# EAGLE design M102X (EAGLE 6.6.0)
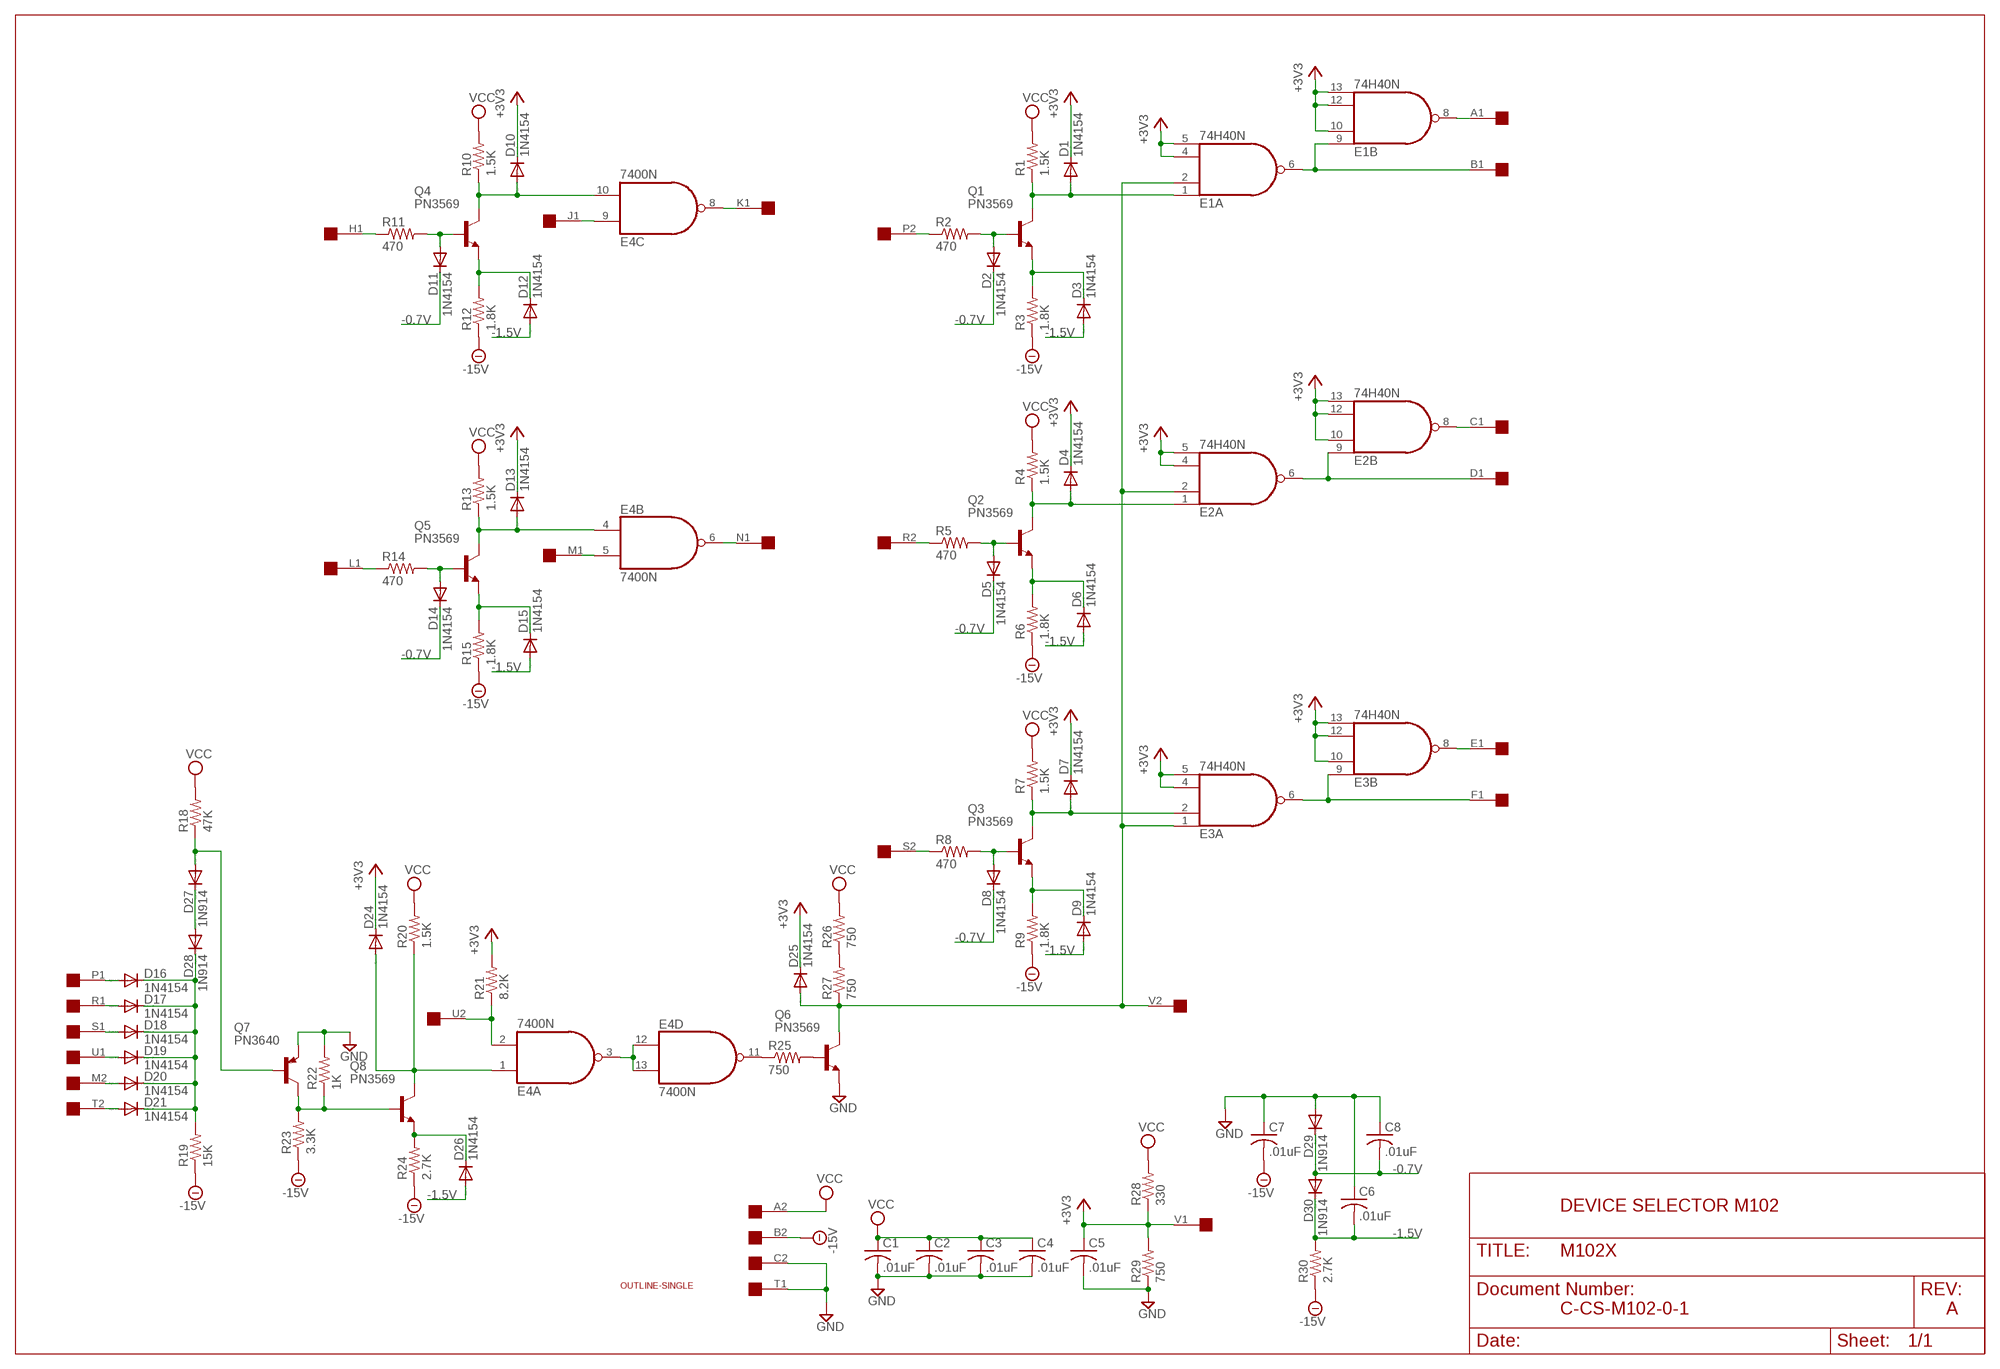
[diagram p0: schematic, sheet 1]

## Parts
C1  .01uF  C-US050-025X075  [C050-025X075]
C2  .01uF  C-US050-025X075  [C050-025X075]
C3  .01uF  C-US050-025X075  [C050-025X075]
C4  .01uF  C-US050-025X075  [C050-025X075]
C5  .01uF  C-US050-025X075  [C050-025X075]
C6  .01uF  C-US050-025X075  [C050-025X075]
C7  .01uF  C-US050-025X075  [C050-025X075]
C8  .01uF  C-US050-025X075  [C050-025X075]
D1  1N4154  1N4148DO35-10  [DO35-10]
D2  1N4154  1N4148DO35-10  [DO35-10]
D3  1N4154  1N4148DO35-10  [DO35-10]
D4  1N4154  1N4148DO35-10  [DO35-10]
D5  1N4154  1N4148DO35-10  [DO35-10]
D6  1N4154  1N4148DO35-10  [DO35-10]
D7  1N4154  1N4148DO35-10  [DO35-10]
D8  1N4154  1N4148DO35-10  [DO35-10]
D9  1N4154  1N4148DO35-10  [DO35-10]
D10  1N4154  1N4148DO35-10  [DO35-10]
D11  1N4154  1N4148DO35-10  [DO35-10]
D12  1N4154  1N4148DO35-10  [DO35-10]
D13  1N4154  1N4148DO35-10  [DO35-10]
D14  1N4154  1N4148DO35-10  [DO35-10]
D15  1N4154  1N4148DO35-10  [DO35-10]
D16  1N4154  1N4148DO35-10  [DO35-10]
D17  1N4154  1N4148DO35-10  [DO35-10]
D18  1N4154  1N4148DO35-10  [DO35-10]
D19  1N4154  1N4148DO35-10  [DO35-10]
D20  1N4154  1N4148DO35-10  [DO35-10]
D21  1N4154  1N4148DO35-10  [DO35-10]
D24  1N4154  1N4148DO35-10  [DO35-10]
D25  1N4154  1N4148DO35-10  [DO35-10]
D26  1N4154  1N4148DO35-10  [DO35-10]
D27  1N914  1N4148DO35-10  [DO35-10]
D28  1N914  1N4148DO35-10  [DO35-10]
D29  1N914  1N4148DO35-10  [DO35-10]
D30  1N914  1N4148DO35-10  [DO35-10]
E1  74H40N  74S20N  [DIL14]
E2  74H40N  74S20N  [DIL14]
E3  74H40N  74S20N  [DIL14]
E4  7400N  [DIL14]
Q1  PN3569  2N1613-NPN-TO39-EBC  [TO39]
Q2  PN3569  2N1613-NPN-TO39-EBC  [TO39]
Q3  PN3569  2N1613-NPN-TO39-EBC  [TO39]
Q4  PN3569  2N1613-NPN-TO39-EBC  [TO39]
Q5  PN3569  2N1613-NPN-TO39-EBC  [TO39]
Q6  PN3569  2N1613-NPN-TO39-EBC  [TO39]
Q7  PN3640  2N3635-PNP-TO39-EBC  [TO39]
Q8  PN3569  2N1613-NPN-TO39-EBC  [TO39]
R1  1.5K  R-US_0207/10  [0207/10]
R2  470  R-US_0207/10  [0207/10]
R3  1.8K  R-US_0207/10  [0207/10]
R4  1.5K  R-US_0207/10  [0207/10]
R5  470  R-US_0207/10  [0207/10]
R6  1.8K  R-US_0207/10  [0207/10]
R7  1.5K  R-US_0207/10  [0207/10]
R8  470  R-US_0207/10  [0207/10]
R9  1.8K  R-US_0207/10  [0207/10]
R10  1.5K  R-US_0207/10  [0207/10]
R11  470  R-US_0207/10  [0207/10]
R12  1.8K  R-US_0207/10  [0207/10]
R13  1.5K  R-US_0207/10  [0207/10]
R14  470  R-US_0207/10  [0207/10]
R15  1.8K  R-US_0207/10  [0207/10]
R18  47K  R-US_0207/10  [0207/10]
R19  15K  R-US_0207/10  [0207/10]
R20  1.5K  R-US_0207/10  [0207/10]
R21  8.2K  R-US_0207/10  [0207/10]
R22  1K  R-US_0207/10  [0207/10]
R23  3.3K  R-US_0207/10  [0207/10]
R24  2.7K  R-US_0207/10  [0207/10]
R25  750  R-US_0207/10  [0207/10]
R26  750  R-US_0207/10  [0207/10]
R27  750  R-US_0207/10  [0207/10]
R28  330  R-US_0207/10  [0207/10]
R29  750  R-US_0207/10  [0207/10]
R30  2.7K  R-US_0207/10  [0207/10]
U$8  SINGLE  [EDGE-CON2]
U$9  OUTLINE-SINGLE  [SINGLE]

## Nets
+3V3 [Supply]: C5.1 D1.C D4.C D7.C D10.C D13.C D24.C D25.C E1.4(A:I2) E1.5(A:I3) E1.10(B:I1) E1.12(B:I2) E1.13(B:I3) E2.4(A:I2) E2.5(A:I3) E2.10(B:I1) E2.12(B:I2) E2.13(B:I3) E3.4(A:I2) E3.5(A:I3) E3.10(B:I1) E3.12(B:I2) E3.13(B:I3) R21.2 R28.1 R29.2 U$8.V1
-0.7V: C8.2 D2.C D5.C D8.C D11.C D14.C D29.C D30.A
-1.5V: C6.2 D3.A D6.A D9.A D12.A D15.A D26.A D30.C R30.2
-15V [Supply]: C7.2 R3.1 R6.1 R9.1 R12.1 R15.1 R19.1 R23.1 R24.1 R30.1 U$8.B2
A1: E1.8(B:O) U$8.A1
B1: E1.6(A:O) E1.9(B:I0) U$8.B1
C1: E2.8(B:O) U$8.C1
D1: E2.6(A:O) E2.9(B:I0) U$8.D1
E1: E3.8(B:O) U$8.E1
F1: E3.6(A:O) E3.9(B:I0) U$8.F1
GND [Supply]: C1.2 C2.2 C3.2 C4.2 C5.2 C6.1 C7.1 C8.1 D29.A Q6.1(E) Q7.1(E) R22.2 R29.1 U$8.C2 U$8.T1
H1: R11.1 U$8.H1
J1: E4.9(C:I0) U$8.J1
K1: E4.8(C:O) U$8.K1
L1: R14.1 U$8.L1
M1: E4.5(B:I1) U$8.M1
M2: D20.A U$8.M2
N1: E4.6(B:O) U$8.N1
N$1: D27.A Q7.2(B) R18.1
N$2: E4.11(D:O) R25.1
N$3: Q6.2(B) R25.2
N$4: D27.C D28.A
N$5: R26.1 R27.2
N$6: Q7.3(C) Q8.2(B) R22.1 R23.2
N$7: D26.C Q8.1(E) R24.2
N$8: D24.A E4.1(A:I0) Q8.3(C) R20.1
N$9: E4.3(A:O) E4.12(D:I0) E4.13(D:I1)
N$10: D10.A E4.10(C:I1) Q4.3(C) R10.1
N$11: D11.A Q4.2(B) R11.2
N$12: D16.C D17.C D18.C D19.C D20.C D21.C D28.C R19.2
N$13: D1.A E1.1(A:I0) Q1.3(C) R1.1
N$14: D12.C Q4.1(E) R12.2
N$15: D13.A E4.4(B:I0) Q5.3(C) R13.1
N$16: D14.A Q5.2(B) R14.2
N$17: D2.A Q1.2(B) R2.2
N$18: D15.C Q5.1(E) R15.2
N$19: D3.C Q1.1(E) R3.2
N$20: D4.A E2.1(A:I0) Q2.3(C) R4.1
N$21: D5.A Q2.2(B) R5.2
N$22: D6.C Q2.1(E) R6.2
N$23: D7.A E3.2(A:I1) Q3.3(C) R7.1
N$24: D8.A Q3.2(B) R8.2
N$25: D9.C Q3.1(E) R9.2
P1: D16.A U$8.P1
P2: R2.1 U$8.P2
R1: D17.A U$8.R1
R2: R5.1 U$8.R2
S1: D18.A U$8.S1
S2: R8.1 U$8.S2
T2: D21.A U$8.T2
U1: D19.A U$8.U1
U2: E4.2(A:I1) R21.1 U$8.U2
V2: D25.A E1.2(A:I1) E2.2(A:I1) E3.1(A:I0) Q6.3(C) R27.1 U$8.V2
VCC [Supply]: C1.1 C2.1 C3.1 C4.1 R1.2 R4.2 R7.2 R10.2 R13.2 R18.2 R20.2 R26.2 R28.2 U$8.A2
Unconnected: U$8.D2 U$8.E2 U$8.F2 U$8.H2 U$8.J2 U$8.K2 U$8.L2 U$8.N2

## Notes on the sheet
- DEVICE SELECTOR M102
- C-CS-M102-0-1 | A

## Power pins joined to a net without a drawn wire
GND: E1.7(P:GND) E2.7(P:GND) E3.7(P:GND) E4.7(P:GND)
VCC: E1.14(P:VCC) E2.14(P:VCC) E3.14(P:VCC) E4.14(P:VCC)

## Library data of the parts
C1-C8 = rcl:C-US: CAPACITOR, American symbol
D1-D21 D24-D30 = diode:1N4148: DIODE high speed (Philips)
E1-E3 = 74xx-us:74*20: Dual 4-input NAND gate
E4 = 74xx-us:74*00: Quad 2-input NAND gate
Q1-Q6 Q8 = transistor:*-NPN-: NPN Transistror BF959 corrected 2008.03.06
Q7 = transistor:*-PNP-: PNP Transistror
R1-R15 R18-R30 = rcl:R-US_: RESISTOR, American symbol
U$8 = dec-con:SINGLE: Single-Height DEC board
U$9 = dec-con:OUTLINE-*: Board outlines for DEC boards.

## Net classes
1 Supply: width 0.813 mm

## Board
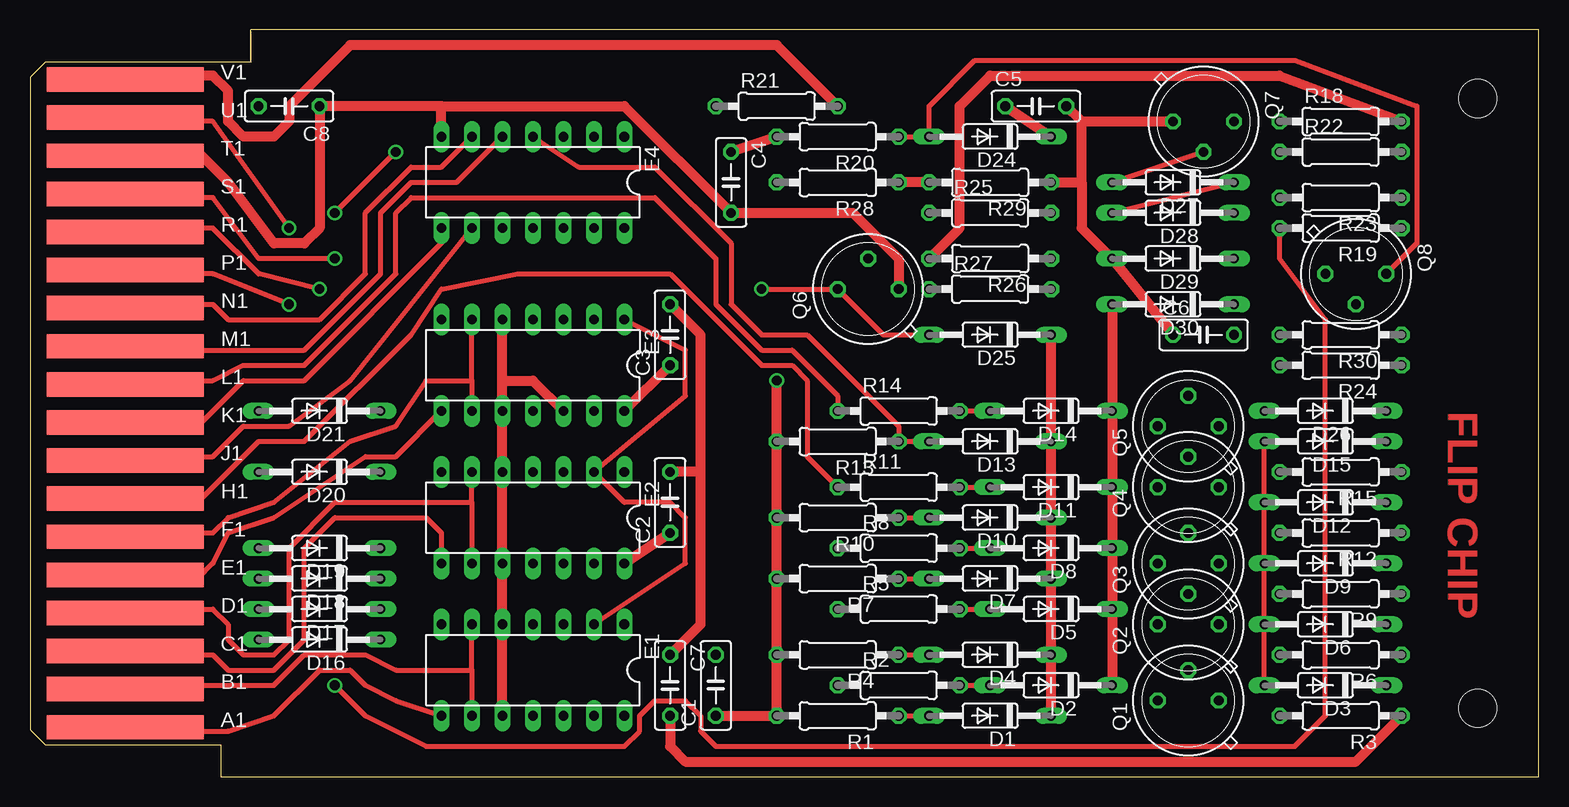
[diagram p1: board, top side]
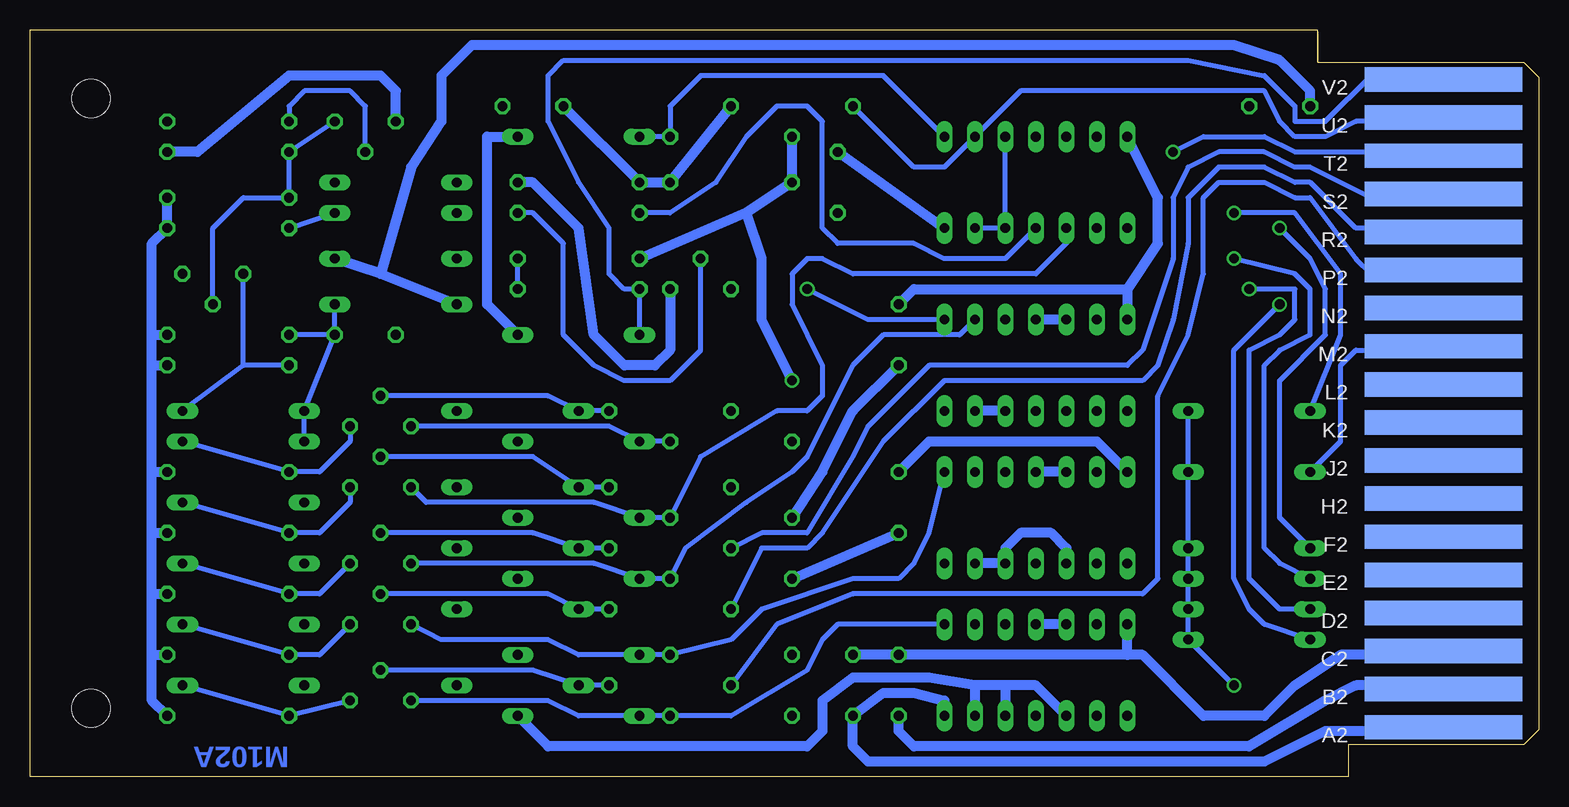
[diagram p2: board, bottom side, seen from below]

Size 125.73 x 62.23 mm. Coordinates in mm from the lower left corner, seen from the top.
Copper layers (1+16): Top 0.035mm / dielectric 1.5mm / Bottom 0.035mm
Design rules "16mils": minimum track width 16mil, minimum drill 32mil, track to track 15mil, track to pad 10mil, pad to pad 10mil, via to via 10mil, smd to smd 10mil, copper to edge 13mil, drill to drill 10mil, minimum pad ring 10mil, minimum via ring 8mil, stop-mask expansion 0mil, vias tented up to drill 0mil, thermal gap 10mil

### Footprints (pad centres in the part's own frame; a part is rotated, then mirrored left to right if it is on the bottom)
C050-025X075 = drill 0.813 octagon: 1 -2.54,0; 2 2.54,0
DO35-10 = drill 0.813 long: A 5.08,0; C -5.08,0
DIL14 = drill 0.813 long: 1 -7.62,-3.81; 2 -5.08,-3.81; 3 -2.54,-3.81; 4 0,-3.81; 5 2.54,-3.81; 6 5.08,-3.81; 7 7.62,-3.81; 8 7.62,3.81; 9 5.08,3.81; 10 2.54,3.81; 11 0,3.81; 12 -2.54,3.81; 13 -5.08,3.81; 14 -7.62,3.81
TO39 = drill 0.813 octagon: 1 0,-2.54; 2 2.54,0; 3 0,2.54
0207/10 = drill 0.813 octagon: 1 -5.08,0; 2 5.08,0
EDGE-CON2 = smd 13.106 x 2.032: A1 7.938,4.128; B1 7.938,7.303; C1 7.938,10.477; D1 7.938,13.652; E1 7.938,16.828; F1 7.938,20.003; H1 7.938,23.177; J1 7.938,26.352; K1 7.938,29.527; L1 7.938,32.703; M1 7.938,35.877; N1 7.938,39.053; P1 7.938,42.227; R1 7.938,45.403; S1 7.938,48.578; T1 7.938,51.752; U1 7.938,54.928; V1 7.938,58.102 | smd 13.106 x 2.032 bottom: A2 7.938,4.128; B2 7.938,7.303; C2 7.938,10.477; D2 7.938,13.652; E2 7.938,16.828; F2 7.938,20.003; H2 7.938,23.177; J2 7.938,26.352; K2 7.938,29.527; L2 7.938,32.703; M2 7.938,35.877; N2 7.938,39.053; P2 7.938,42.227; R2 7.938,45.403; S2 7.938,48.578; T2 7.938,51.752; U2 7.938,54.928; V2 7.938,58.102
SINGLE = hole 3.175: 120.65,56.515; 120.65,5.715

### Placement (x,y rotation side)
C1  57.15,7.62 90 top
C2  53.34,22.86 90 top
C3  53.34,36.83 90 top
C4  58.42,49.53 270 top
C5  83.82,55.88 0 top
C6  97.79,36.83 0 top
C7  53.34,7.62 270 top
C8  21.59,55.88 180 top
D1  80.01,5.08 180 top
D2  85.09,7.62 180 top
D3  107.95,7.62 180 top
D4  80.01,10.16 180 top
D5  85.09,13.97 180 top
D6  107.95,12.7 180 top
D7  80.01,16.51 180 top
D8  85.09,19.05 180 top
D9  107.95,17.78 180 top
D10  80.01,21.59 180 top
D11  85.09,24.13 180 top
D12  107.95,22.86 180 top
D13  80.01,27.94 180 top
D14  85.09,30.48 180 top
D15  107.95,27.94 180 top
D16  24.13,11.43 180 top
D17  24.13,13.97 180 top
D18  24.13,16.51 180 top
D19  24.13,19.05 180 top
D20  24.13,25.4 180 top
D21  24.13,30.48 180 top
D24  80.01,53.34 180 top
D25  80.01,36.83 180 top
D26  107.95,30.48 180 top
D27  95.25,49.53 180 top
D28  95.25,46.99 180 top
D29  95.25,43.18 180 top
D30  95.25,39.37 180 top
E1  41.91,8.89 180 top
E2  41.91,21.59 180 top
E3  41.91,34.29 180 top
E4  41.91,49.53 180 top
Q1  96.52,6.35 90 top
Q2  96.52,12.7 90 top
Q3  96.52,17.78 90 top
Q4  96.52,24.13 90 top
Q5  96.52,29.21 90 top
Q6  69.85,40.64 90 top
Q7  97.79,54.61 270 top
Q8  110.49,41.91 270 top
R1  67.31,5.08 180 top
R2  72.39,7.62 0 top
R3  109.22,5.08 180 top
R4  67.31,10.16 180 top
R5  72.39,13.97 0 top
R6  109.22,10.16 180 top
R7  67.31,16.51 180 top
R8  72.39,19.05 0 top
R9  109.22,15.24 180 top
R10  67.31,21.59 180 top
R11  72.39,24.13 0 top
R12  109.22,20.32 180 top
R13  67.31,27.94 180 top
R14  72.39,30.48 0 top
R15  109.22,25.4 180 top
R18  109.22,54.61 0 top
R19  109.22,45.72 180 top
R20  67.31,53.34 180 top
R21  62.23,55.88 0 top
R22  109.22,52.07 0 top
R23  109.22,48.26 180 top
R24  109.22,34.29 180 top
R25  80.01,46.99 0 top
R26  80.01,43.18 180 top
R27  80.01,40.64 0 top
R28  67.31,49.53 180 top
R29  80.01,49.53 180 top
R30  109.22,36.83 180 top
U$8  0,0 0 top
U$9  0,0 0 top

### Tracks (layer width: path | path; a pad name or v marks a point on that pad's centre or on a via)
+3V3
  Top 0.813: E1.10 E1.5 E2.10 E2.5 E3.10 39.37,33.02 | 39.37,33.02 E3.5 | R29.2 R28.1 | D25.C D13.C D10.C D7.C D4.C D1.C | U$8.V1 8.89,58.42 15.24,58.42 16.51,57.15 16.51,54.61 17.78,53.34 20.32,53.34 21.59,54.61 21.59,55.88 26.67,60.96 62.23,60.96 R21.2 | E3.12 41.91,33.02 39.37,33.02 | D24.C C5.1
  Bottom 0.813: E1.10 41.91,7.62 44.45,7.62 | 44.45,7.62 E1.12 | 46.99,7.62 E1.13 | 44.45,7.62 46.99,7.62 | 46.99,7.62 50.8,8.26 57.15,8.26 59.69,6.35 59.69,3.81 60.96,2.54 82.55,2.54 D1.C | E2.10 39.37,19.05 40.64,20.32 43.18,20.32 44.45,19.05 E2.12 E2.13 | E1.5 E1.4 | E2.5 E2.4 | E3.5 E3.4 | R21.2 R28.1 R29.2 C5.1 | D24.C 87.63,53.34 87.63,39.37 D25.C | E3.12 E3.13
-0.7V
  Top 0.813: D30.A D14.C D11.C D8.C D5.C D2.C
  Bottom 0.813: 96.52,41.91 D30.A | 96.52,41.91 D29.C | 96.52,41.91 93.98,50.8 91.44,54.61 91.44,58.42 88.9,60.96 25.4,60.96 21.59,59.69 19.05,57.15 C8.2
-1.5V
  Top 0.406: D15.A D12.A D9.A D6.A D3.A
  Bottom 0.406: D15.A D26.A C6.2 | C6.2 R30.2 | C6.2 D30.C
-15V
  Top 0.813: C7.2 53.34,2.54 54.61,1.27 110.49,1.27 R3.1
  Bottom 0.813: U$8.B2 8.26,7.62 15.24,7.62 17.78,6.35 24.13,2.54 52.07,2.54 53.34,3.81 C7.2 | R3.1 115.57,6.35 115.57,10.16 | 115.57,10.16 R6.1 | 115.57,34.29 115.57,36.83 | 115.57,36.83 R30.1 | 115.57,15.24 R9.1 | 115.57,10.16 115.57,15.24 | 115.57,25.4 R15.1 | 115.57,15.24 115.57,20.32 | 115.57,20.32 115.57,25.4 | 115.57,20.32 R12.1 | 115.57,34.29 R24.1 | 115.57,25.4 115.57,34.29 | R23.1 R19.1 115.57,44.45 115.57,36.83
A1
  Top 0.406: U$8.A1 8.26,3.81 16.51,3.81 20.32,5.08 24.13,8.89 26.67,8.89 27.94,7.62 30.48,6.35 E1.8
B1
  Top 0.406: U$8.B1 8.26,7.62 20.32,7.62 22.86,10.16 27.94,10.16 30.48,8.89 36.83,8.89 | 36.83,8.89 E1.9 | 36.83,8.89 E1.6
C1
  Top 0.406: U$8.C1 8.26,10.16 15.24,10.16 16.51,8.89 20.32,8.89 22.86,11.43 22.86,19.05 25.4,21.59 33.02,21.59 34.29,20.32 E2.8
D1
  Top 0.406: U$8.D1 8.26,13.97 15.24,13.97 16.51,12.7 16.51,11.43 17.78,10.16 20.32,10.16 21.59,11.43 21.59,19.05 25.4,22.86 36.83,22.86 | 36.83,22.86 E2.9 | 36.83,22.86 E2.6
E1
  Top 0.406: U$8.E1 8.26,16.51 13.97,16.51 15.24,17.78 16.51,20.32 20.32,21.59 27.94,26.67 30.48,26.67 E3.8
F1
  Top 0.406: U$8.F1 8.26,20.32 15.24,20.32 16.51,21.59 20.32,22.86 26.67,27.94 30.48,29.21 33.02,33.02 36.83,33.02 | 36.83,33.02 E3.6 | 36.83,33.02 E3.9
GND
  Top 0.813: U$8.T1 8.89,52.07 13.97,52.07 16.51,49.53 20.32,44.45 22.86,44.45 24.13,45.72 C8.1 34.29,55.88 | C6.1 D29.A 87.63,45.72 87.63,49.53 | E4.7 34.29,55.88 | 34.29,55.88 49.53,55.88 C4.2 68.58,46.99 72.39,43.18 Q6.1 | C3.2 55.88,36.83 55.88,25.4 | 55.88,25.4 C2.2 | C7.1 55.88,12.7 55.88,25.4 | R29.1 87.63,49.53 | 87.63,49.53 87.63,54.61 | 87.63,54.61 C5.2 | 87.63,54.61 Q7.1
  Bottom 0.813: U$8.C2 8.26,10.16 16.51,10.16 20.32,7.62 22.86,5.08 27.94,5.08 33.02,10.16 34.29,10.16 | 34.29,10.16 E1.7 | 34.29,10.16 C7.1 C1.2 | R22.2 111.76,52.07 104.14,58.42 96.52,58.42 95.25,57.15 Q7.1 | E2.7 36.83,27.94 50.8,27.94 C2.2 | 34.29,40.64 E3.7 | 34.29,40.64 52.07,40.64 C3.2 | Q6.1 72.39,35.56 73.66,34.29 76.2,34.29 78.74,36.83 80.01,45.72 83.82,49.53 R29.1 | E4.7 31.75,48.26 31.75,44.45 34.29,40.64
H1
  Top 0.406: U$8.H1 8.26,22.86 13.97,22.86 19.05,27.94 22.86,27.94 31.75,36.83 34.29,40.64 40.64,41.91 53.34,41.91 60.96,34.29 63.5,34.29 64.77,33.02 64.77,26.67 R11.1
J1
  Top 0.406: U$8.J1 8.89,26.67 15.24,26.67 17.78,29.21 21.59,29.21 26.67,33.02 E4.9
K1
  Top 0.406: U$8.K1 8.89,29.21 13.97,29.21 17.78,33.02 22.86,33.02 34.29,44.45 E4.8
L1
  Top 0.406: U$8.L1 8.89,33.02 15.24,33.02 17.78,34.29 22.86,34.29 30.48,41.91 30.48,46.99 31.75,48.26 52.07,48.26 57.15,43.18 57.15,39.37 60.96,35.56 63.5,35.56 67.31,31.75 R14.1
M1
  Top 0.406: U$8.M1 8.89,35.56 22.86,35.56 29.21,41.91 29.21,46.99 31.75,49.53 35.56,49.53 E4.5
M2
  Bottom 0.406: U$8.M2 8.89,35.56 15.24,35.56 16.51,34.29 16.51,27.94 D20.A
N1
  Top 0.406: U$8.N1 8.89,39.37 15.24,39.37 16.51,38.1 24.13,38.1 27.94,41.91 27.94,46.99 31.75,50.8 34.29,50.8 E4.6
N$1
  Top 0.406: D27.A Q7.2
  Bottom 0.406: Q7.2 97.79,55.88 99.06,57.15 102.87,57.15 104.14,55.88 R18.1
N$2
  Bottom 0.406: E4.11 44.45,43.18 49.53,43.18 52.07,44.45 58.42,44.45 59.69,45.72 59.69,54.61 60.96,55.88 63.5,55.88 66.04,53.34 68.58,49.53 72.39,46.99 R25.1
N$3
  Bottom 0.406: R25.2 83.82,46.99 81.28,44.45 81.28,36.83 78.74,34.29 76.2,33.02 72.39,33.02 69.85,35.56 Q6.2
N$4
  Top 0.406: D28.A D27.C
N$5
  Bottom 0.406: R27.2 R26.1
N$6
  Bottom 0.406: Q7.3 R22.1 R23.2 107.95,48.26 110.49,45.72 Q8.2
N$7
  Bottom 0.406: R24.2 107.95,34.29 | 107.95,34.29 Q8.1 | 107.95,34.29 D26.C
N$8
  Top 0.406: R20.1 D24.A 74.93,55.88 78.74,59.69 105.41,59.69 115.57,55.88 115.57,44.45 Q8.3
  Bottom 0.406: E4.1 54.61,58.42 69.85,58.42 72.39,55.88 R20.1 D24.A
N$9
  Bottom 0.406: E4.3 E4.12 E4.13
N$10
  Top 0.406: R10.1 D10.A
  Bottom 0.406: Q4.3 92.71,22.86 78.74,22.86 D10.A R10.1 69.85,26.67 63.5,30.48 60.96,30.48 59.69,31.75 59.69,34.29 62.23,39.37 62.23,41.91 60.96,43.18 59.69,43.18 57.15,41.91 41.91,41.91 39.37,44.45 E4.10
N$11
  Top 0.406: R11.2 D11.A
  Bottom 0.406: R11.2 D11.A 83.82,26.67 Q4.2
N$12  (via drill 0.81)
  Top 0.406: v25.4,7.62 27.94,5.08 33.02,2.54 49.53,2.54 50.8,3.81 50.8,5.08 52.07,6.35 54.61,6.35 55.88,5.08 55.88,3.81 57.15,2.54 105.41,2.54 107.95,5.08 107.95,38.1 104.14,43.18 R19.2
  Bottom 0.406: D21.C D20.C D19.C D18.C D17.C D16.C v25.4,7.62 | R19.2 D28.C
N$13
  Top 0.406: R1.1 D1.A
  Bottom 0.406: Q1.3 82.55,6.35 80.01,5.08 D1.A R1.1 67.31,5.08 60.96,8.89 59.69,11.43 58.42,12.7 E1.1
N$14
  Bottom 0.406: D12.C R12.2 101.6,20.32 99.06,22.86 Q4.1
N$15
  Top 0.406: D13.A R13.1 72.39,29.21 64.77,36.83 60.96,36.83 58.42,39.37 58.42,44.45 52.07,50.8 45.72,50.8 E4.4
  Bottom 0.406: D13.A R13.1 D13.A | D13.A 77.47,29.21 Q5.3
N$16
  Top 0.406: R14.2 D14.A
  Bottom 0.406: R14.2 D14.A 82.55,31.75 Q5.2
N$17
  Top 0.406: R2.2 D2.A
  Bottom 0.406: Q1.2 83.82,8.89 D2.A R2.2
N$18
  Bottom 0.406: D15.C R15.2 101.6,25.4 99.06,27.94 Q5.1
N$19
  Bottom 0.406: D3.C R3.2 Q1.1
N$20
  Top 0.406: R4.1 D4.A
  Bottom 0.406: Q2.3 91.44,11.43 82.55,11.43 80.01,10.16 D4.A R4.1 67.31,11.43 64.77,13.97 57.15,16.51 53.34,16.51 52.07,17.78 50.8,20.32 E2.1
N$21
  Top 0.406: R5.2 D5.A
  Bottom 0.406: R5.2 D5.A 82.55,15.24 Q2.2
N$22
  Bottom 0.406: D6.C R6.2 101.6,10.16 Q2.1
N$23
  Top 0.406: R7.1 D7.A
  Bottom 0.406: Q3.3 78.74,17.78 D7.A R7.1 71.12,19.05 66.04,22.86 62.23,25.4 60.96,26.67 57.15,34.29 54.61,36.83 48.26,36.83 E3.2
N$24
  Top 0.406: R8.2 D8.A
  Bottom 0.406: R8.2 D8.A 83.82,20.32 Q3.2
N$25
  Bottom 0.406: D9.C R9.2 101.6,15.24 Q3.1
P1  (via drill 0.81)
  Top 0.406: U$8.P1 8.89,41.91 15.24,41.91 v21.59,39.37
  Bottom 0.406: D16.A 22.86,12.7 24.13,13.97 25.4,16.51 25.4,35.56 v21.59,39.37
P2
  Bottom 0.406: R2.1 63.5,12.7 57.15,15.24 33.02,15.24 31.75,16.51 31.75,31.75 29.21,36.83 27.94,41.91 27.94,48.26 26.67,49.53 22.86,49.53 20.32,48.26 19.05,48.26 15.24,43.18 13.97,41.91 8.89,41.91 U$8.P2
R1  (via drill 0.81)
  Top 0.406: U$8.R1 8.89,45.72 15.24,45.72 19.05,41.91 v24.13,40.64
  Bottom 0.406: D17.A 21.59,13.97 24.13,16.51 24.13,35.56 21.59,36.83 20.32,38.1 20.32,40.64 v24.13,40.64
R2
  Bottom 0.406: U$8.R2 8.89,45.72 15.24,45.72 19.05,49.53 20.32,49.53 22.86,50.8 26.67,50.8 29.21,48.26 29.21,44.45 30.48,38.1 31.75,34.29 33.02,33.02 49.53,33.02 54.61,27.94 59.69,20.32 60.96,19.05 64.77,19.05 R5.1
S1  (via drill 0.81)
  Top 0.406: U$8.S1 8.89,48.26 15.24,48.26 19.05,43.18 v25.4,43.18
  Bottom 0.406: D18.A 21.59,17.78 22.86,19.05 22.86,34.29 21.59,35.56 19.05,36.83 19.05,40.64 20.32,41.91 v25.4,43.18
S2
  Bottom 0.406: R8.1 64.77,20.32 60.96,20.32 57.15,26.67 55.88,29.21 50.8,34.29 34.29,34.29 33.02,35.56 30.48,43.18 30.48,48.26 29.21,50.8 26.67,52.07 22.86,52.07 20.32,50.8 19.05,50.8 13.97,48.26 8.89,48.26 U$8.S2
T2  (via drill 0.81)
  Top 0.406: v25.4,46.99 v30.48,52.07
  Bottom 0.406: D21.A 16.51,36.83 16.51,41.91 20.32,46.99 v25.4,46.99 | U$8.T2 8.89,52.07 20.32,52.07 22.86,53.34 27.94,53.34 v30.48,52.07
U1  (via drill 0.81)
  Top 0.406: U$8.U1 8.89,54.61 15.24,54.61 v21.59,45.72
  Bottom 0.406: D19.A 21.59,21.59 21.59,33.02 17.78,36.83 17.78,40.64 19.05,43.18 v21.59,45.72
U2
  Bottom 0.406: U$8.U2 8.89,54.61 15.24,54.61 17.78,53.34 20.32,53.34 21.59,54.61 22.86,57.15 43.18,57.15 E4.2 49.53,50.8 52.07,50.8 R21.1
V2  (via drill 0.81)
  Top 0.406: v60.96,40.64 Q6.3 71.12,36.83 D25.A | E3.1 54.61,35.56 54.61,31.75 E2.2 49.53,22.86 53.34,22.86 54.61,21.59 54.61,17.78 E1.2
  Bottom 0.406: U$8.V2 8.89,58.42 13.97,58.42 17.78,54.61 20.32,54.61 20.32,55.88 22.86,58.42 29.21,59.69 81.28,59.69 82.55,58.42 82.55,54.61 80.01,49.53 77.47,45.72 77.47,41.91 76.2,40.64 R27.1 D25.A | E3.1 55.88,38.1 v60.96,40.64
VCC  (via drill 0.81)
  Top 0.813: R20.2 C4.1 | v62.23,33.02 R13.2 R10.2 R7.2 R4.2 R1.2 C1.1 | C3.1 E3.14 | C2.1 E2.14 | R26.2 77.47,45.72 77.47,55.88 80.01,58.42 104.14,58.42 R18.2
  Bottom 0.813: U$8.A2 8.26,3.81 17.78,3.81 22.86,1.27 55.88,1.27 57.15,2.54 C1.1 54.61,6.99 52.07,6.99 49.53,6.35 E1.14 | C3.1 57.15,30.48 59.69,25.4 R10.2 | R7.2 C2.1 | R20.2 R28.2 66.04,46.99 | C4.1 E4.14 | 66.04,46.99 64.77,43.18 64.77,38.1 v62.23,33.02 | 66.04,46.99 R26.2

### Text on the board
Top: FLIP CHIP
Bottom: M102A